# Altium project PCB_Project_2.PrjPcb
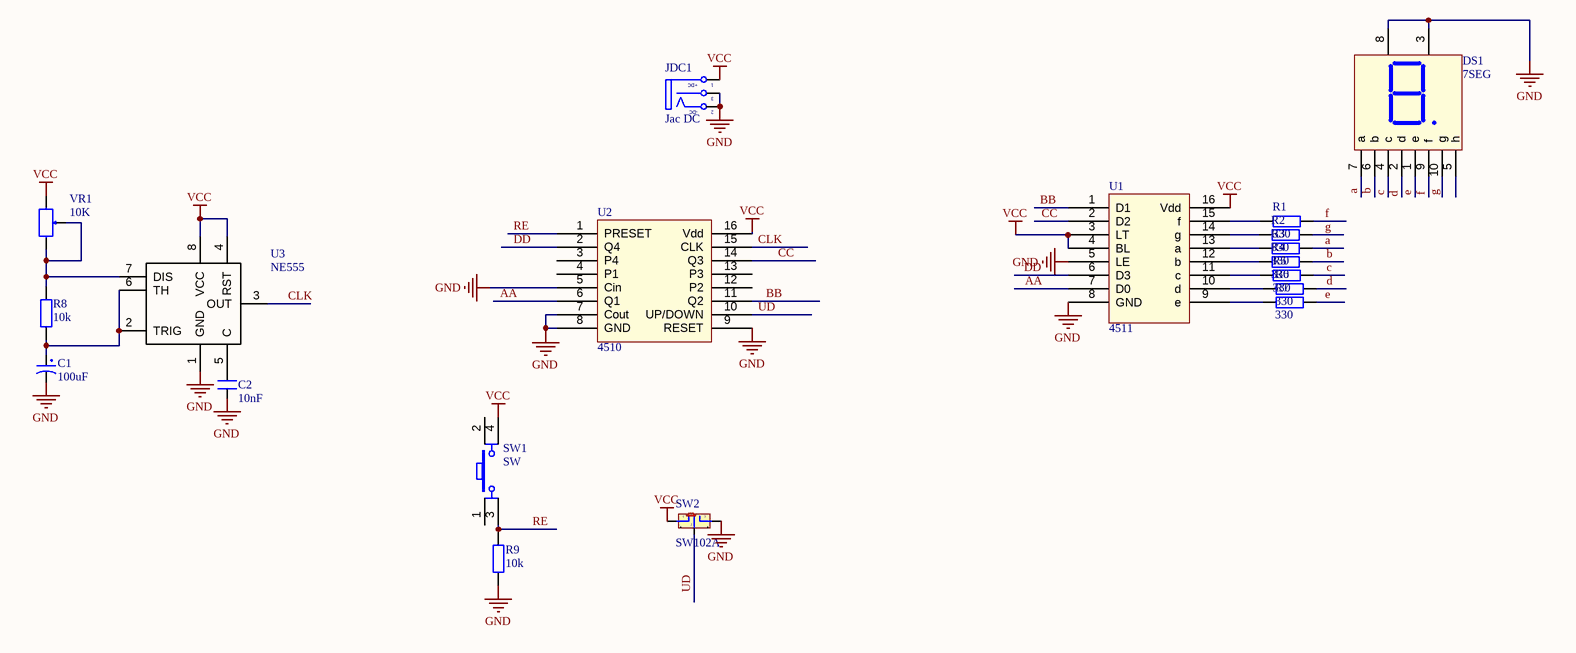
[diagram p0: Sheet1.SchDoc]
1 sheet, 19 parts. Net scope: global (net labels, ports and power ports of the same name join across sheets).
Board file: PCB1.PcbDoc

## Sheet Sheet1.SchDoc
size 594 x 420 mm; SheetNumber: 1; SheetTotal: 1

### Parts
C1  100uF  [CP1/2]
C2  10nF  [CN1]
DS1  7SEG  [LED7SEG-1-0.56]
JDC1  Jac DC  [DC-IN]
R1  330  [R1/4W]
R2  330  [R1/4W]
R3  330  [R1/4W]
R4  330  [R1/4W]
R5  330  [R1/4W]
R6  330  [R1/4W]
R7  330  [R1/4W]
R8  10k  [R1/4W]
R9  10k  [R1/4W]
SW1  SW  [SW4]
SW2  SW102A  [SW102]
U1  4511  [DIP 16]
U2  4510  [DIP 16]
U3  NE555  [DIP8]
VR1  10K  [VR]

### Nets
GND: C1.2 C2.1 DS1.3(Vcc) DS1.8(Vcc) JDC1.2(TN) JDC1.3(S) R9.1 SW2.3 U1.5(LE) U1.8(GND) U2.5(Cin) U2.7(Cout) U2.8(GND) U2.9(RESET) U3.1(GND)
VCC: JDC1.1(T) SW1.4 SW2.1 U1.3(LT) U1.4(BL) U1.16(Vdd) U2.16(Vdd) U3.4(RST) U3.8(VCC) VR1.1
a: DS1.7(a) R3.2
AA: U1.7(D0) U2.6(Q1)
b: DS1.6(b) R4.2
BB: U1.1(D1) U2.11(Q2)
c: DS1.4(c) R5.2
CC: U1.2(D2) U2.14(Q3)
CLK: U2.15(CLK) U3.3(OUT)
d: DS1.2(d) R6.2
DD: U1.6(D3) U2.2(Q4)
e: DS1.1(e) R7.2
f: DS1.9(f) R1.2
g: DS1.10(g) R2.2
RE: R9.2 SW1.3 U2.1(PRESET)
UD: SW2.2 U2.10(UP/DOWN)
NetC1_1: C1.1 R8.1 U3.2(TRIG) U3.6(TH)
NetC2_2: C2.2 U3.5(C)
NetR1_1: R1.1 U1.15(f)
NetR2_1: R2.1 U1.14(g)
NetR3_1: R3.1 U1.13(a)
NetR4_1: R4.1 U1.12(b)
NetR5_1: R5.1 U1.11(c)
NetR6_1: R6.1 U1.10(d)
NetR7_1: R7.1 U1.9(e)
NetR8_2: R8.2 U3.7(DIS) VR1.2 VR1.3

Not connected (* = marked no-connect by the designer): DS1 5(h); SW1 1 2; SW2 4 5; U2 3(P4) 4(P1) 12(P2) 13(P3)

### Notes on the sheet
- DWG NO:
- REV:
- THIS DOCUMENT AND THE DATA DISCLOSED HEREIN OR
- HEREWITH IS THE PROPERTY OF ALTIUM LIMITED AND MAY
- BE FREELY DISTRIBUTED IN WHOLE. NO RIGHTS ARE
- RESERVED OR EXPRESS OR IMPLIED WARANTEE GIVEN.
- REVISION
- DESCRIPTION
- DATE
- APPROVED
- ENG:
- APPROVALS
- PROJECT
- DSN:
- CHK:
- REFERENCE DOCUMENTS
- PROJECT REVISION:
- TITLE
- DOCUMENT REVISION:
- DESIGN ITEM:
- BOM:
- FAB DWG:
- PCB DWG:
- ASSY DWG:
- SCALE:
- A2
- SIZE
- CAGE CODE
- FILE NAME
- DWG NO.
- SHEET
- OF
- REV
- (in symbol DCIN) +DC; -DC

### Library data of the parts
C1 = CP1: Cap P  0,1uF < 22uF , 16 - 50V; Value: 10uF/50V; Description 1: 10 => 220uF/6,3V/10V - 10uF => 100uF/16V; Description 2: 0,1uF => 33uF/50V - 10uF => 22uF/63V; Description 3: 0,47uF => 10uF/100V
C2 = CN1: Cap np  1pF - 472pF; Value: 100pF
DS1 = LED7SEG-1: 14.2 mm General Purpose Blue 7-Segment Display: CC, RH DP, Gray Surface; MinimumIntensity: 2020 ucd; Note: IF = 10 mA; Published: 8-Jun-2000; LatestRevisionDate: 17-Dec-2003; LatestRevisionNote: Schematic revised, PCB Footprint replaced.; DatasheetDocument: 24-Sep-2002; PackageDocument: 24-Sep-2002; PackageReference: H; Publisher: Altium Limited; Colour: Blue; ComponentLink1Description: Manufacturer Link; ComponentLink1URL: http://www.agilent.com/
JDC1 = DCIN: Jac DC input; Value: Jac DC
R1-R9 = R1/4W: Resistor 1/4W; Value: R1/4W - 1K
SW1 = SW4: Switch button 4 pin; Value: Button chip 4 pin
SW2 = SW102A: Switch 102 on Broad; Value: Switch 102 On Board
U3 = NE555: TIMER IC; Manufacturer Part Number: NE555DT; Manufacturer: STMicroelectronics; Frequency: 500kHz; Voltage - Supply: 4.5 V ~ 16 V; Current: 200mA; Supplier 1: Digi-Key; Supplier Part Number 1: 497-1962-2-ND; Supplier: Digi-Key; Category: Integrated Circuits (ICs); Supplier Part Number: 497-1962-2-ND; Package / Case: 8-SOIC (3.9mm Width); Packaging: Tape & Reel (TR); RoHS: RoHS Compliant; Operating Temperature: 0°C ~ 70°C; Count: -; Type: 555 Type, Timer/Oscillator (Single)
VR1 = VR: Var Resistor; Value: VR 10K